# Altium schematic sheet Receiving.SchDoc: Sample Sheet Title
size B; Date: MM/DD/YYYY; Author: Sample Author; Organization: ORGANIZATION; Address1: ADDRESS 1; Address2: ADDRESS 2; Address3: ADDRESS 3; Address4: ADDRESS 4; Revision: -; SheetNumber: 3; SheetTotal: 6; ENG_APP_DATE: --/--/--; DSN_APP_DATE: --/--/--; CHK_APP_DATE: --/--/--
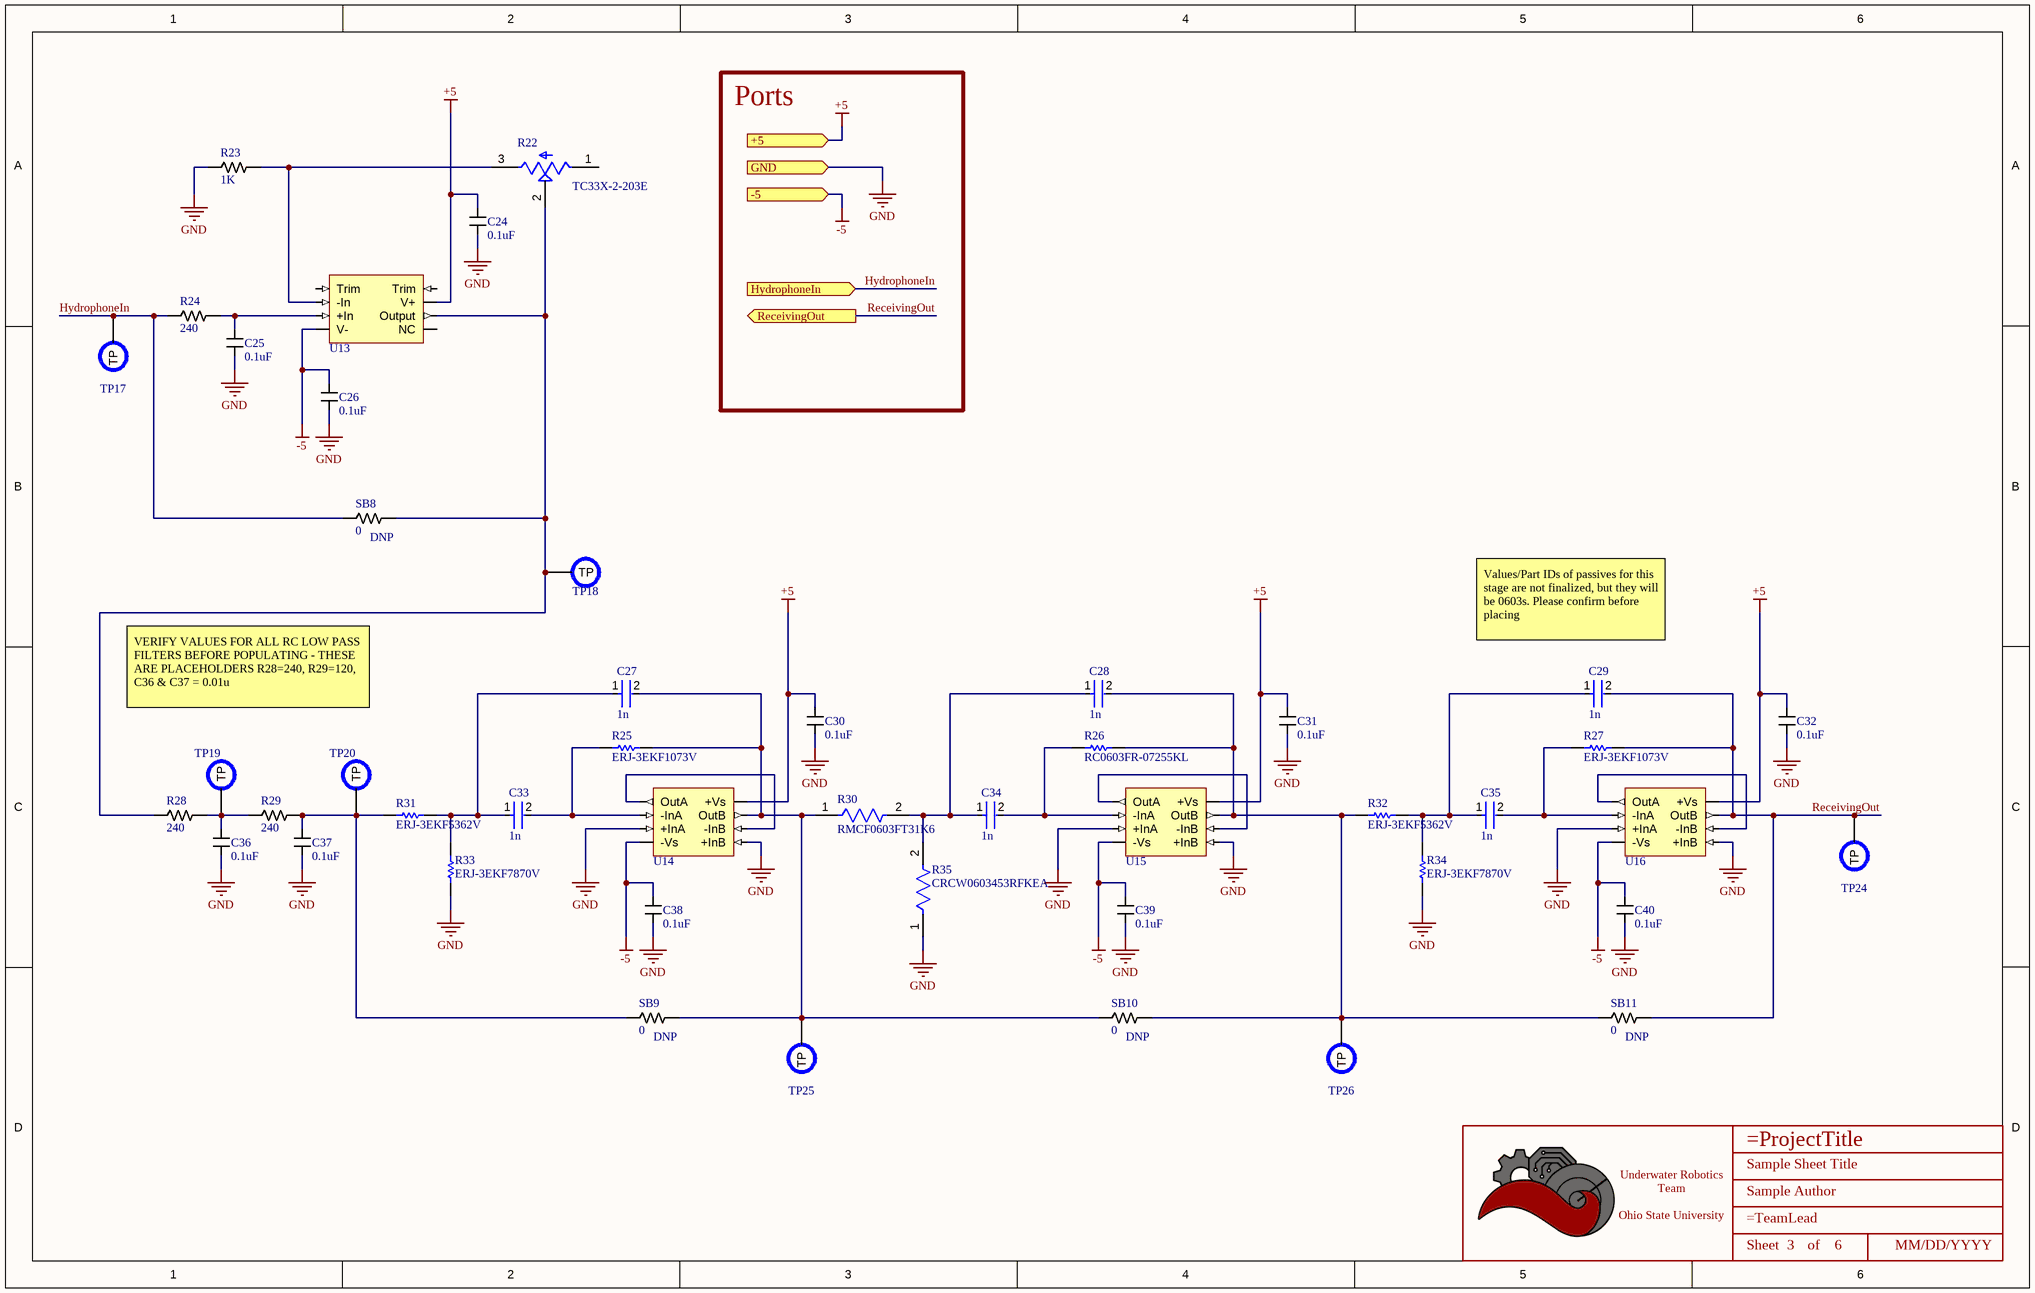
[diagram p0: Receiving.SchDoc]

## Parts
*  Title_Block  [LOGO]  (value not drawn)  (graphical)
C24  value 0.1uF  [CAPACITOR_0603]  (hidden comment: 100nF Ceramic 6.3V)
C25  value 0.1uF  [CAPACITOR_0603]  (hidden comment: 100nF Ceramic 6.3V)
C26  value 0.1uF  [CAPACITOR_0603]  (hidden comment: 100nF Ceramic 6.3V)
C27  1n  [FP-0603-L_1_6_0_15-W_0_81-IPC_A]
C28  1n  [FP-0603-L_1_6_0_15-W_0_81-IPC_A]
C29  1n  [FP-0603-L_1_6_0_15-W_0_81-IPC_A]
C30  value 0.1uF  [CAPACITOR_0603]  (hidden comment: 100nF Ceramic 6.3V)
C31  value 0.1uF  [CAPACITOR_0603]  (hidden comment: 100nF Ceramic 6.3V)
C32  value 0.1uF  [CAPACITOR_0603]  (hidden comment: 100nF Ceramic 6.3V)
C33  1n  [FP-0603-L_1_6_0_15-W_0_81-IPC_A]
C34  1n  [FP-0603-L_1_6_0_15-W_0_81-IPC_A]
C35  1n  [FP-0603-L_1_6_0_15-W_0_81-IPC_A]
C36  value 0.1uF  [CAPACITOR_0603]  (hidden comment: 100nF Ceramic 6.3V)
C37  value 0.1uF  [CAPACITOR_0603]  (hidden comment: 100nF Ceramic 6.3V)
C38  value 0.1uF  [CAPACITOR_0603]  (hidden comment: 100nF Ceramic 6.3V)
C39  value 0.1uF  [CAPACITOR_0603]  (hidden comment: 100nF Ceramic 6.3V)
C40  value 0.1uF  [CAPACITOR_0603]  (hidden comment: 100nF Ceramic 6.3V)
R22  TC33X-2-203E  [TRIM_TC33X-2-203E]
R23  Value  (Ohms): 1K  [RESISTOR_0603]  (hidden comment: 1k Ohm 5% 1/8W)
R24  Value  (Ohms): 240  [RESISTOR_0603]  (hidden comment: RES SMD 240 OHM 5% 1/10W 0603)
R25  ERJ-3EKF1073V  [RESC1608X55X30ML15T15]
R26  RC0603FR-07255KL  [RESC1608X55X25LL10T15]
R27  ERJ-3EKF1073V  [RESC1608X55X30ML15T15]
R28  Value  (Ohms): 240  [RESISTOR_0603]  (hidden comment: RES SMD 240 OHM 5% 1/10W 0603)
R29  Value  (Ohms): 240  [RESISTOR_0603]  (hidden comment: RES SMD 240 OHM 5% 1/10W 0603)
R30  RMCF0603FT31K6  [FP-RMCF0603-IPC_A]
R31  ERJ-3EKF5362V  [RESC1608X55X30NL15T15]
R32  ERJ-3EKF5362V  [RESC1608X55X30NL15T15]
R33  ERJ-3EKF7870V  [RESC1608X55X30ML15T15]
R34  ERJ-3EKF7870V  [RESC1608X55X30ML15T15]
R35  CRCW0603453RFKEA  [FP-CRCW0603-e3-IPC_C]
SB8  Value  (Ohms): 0  [RESISTOR_0603]  (hidden comment: 0 Ohm Jumper No Fit)
SB9  Value  (Ohms): 0  [RESISTOR_0603]  (hidden comment: 0 Ohm Jumper No Fit)
SB10  Value  (Ohms): 0  [RESISTOR_0603]  (hidden comment: 0 Ohm Jumper No Fit)
SB11  Value  (Ohms): 0  [RESISTOR_0603]  (hidden comment: 0 Ohm Jumper No Fit)
TP17  PCB Test Point  [TESTPOINT_1.2MM]  (value not drawn)  (no BOM)
TP18  PCB Test Point  [TESTPOINT_1.2MM]  (value not drawn)  (no BOM)
TP19  PCB Test Point  [TESTPOINT_1.2MM]  (value not drawn)  (no BOM)
TP20  PCB Test Point  [TESTPOINT_1.2MM]  (value not drawn)  (no BOM)
TP24  PCB Test Point  [TESTPOINT_1.2MM]  (value not drawn)  (no BOM)
TP25  PCB Test Point  [TESTPOINT_1.2MM]  (value not drawn)  (no BOM)
TP26  PCB Test Point  [TESTPOINT_1.2MM]  (value not drawn)  (no BOM)
U13  IC OPAMP GP 1 CIRCUIT 8SOIC  [SOIC-8]  (value not drawn)
U14  IC VOLTAGE FEEDBACK 2 CIRC 8SOIC  [SOIC-8]  (value not drawn)
U15  IC VOLTAGE FEEDBACK 2 CIRC 8SOIC  [SOIC-8]  (value not drawn)
U16  IC VOLTAGE FEEDBACK 2 CIRC 8SOIC  [SOIC-8]  (value not drawn)

## Ports
+5 (in), -5 (in), GND (in), HydrophoneIn (in), ReceivingOut (out)

## Nets
+5: C24.1 C30.1 C31.1 C32.1 U13.7(V+) U14.8(+Vs) U15.8(+Vs) U16.8(+Vs) ; port +5
-5: C26.1 C38.1 C39.1 C40.1 U13.4(V-) U14.4(-Vs) U15.4(-Vs) U16.4(-Vs) ; port -5
GND: C24.2 C25.2 C26.2 C30.2 C31.2 C32.2 C36.2 C37.2 C38.2 C39.2 C40.2 R23.2 R33.1 R34.1 R35.1 U14.3(+InA) U14.5(+InB) U15.3(+InA) U15.5(+InB) U16.3(+InA) U16.5(+InB) ; port GND
HydrophoneIn: R24.2 SB8.2 TP17.TP ; port HydrophoneIn
ReceivingOut: C29.2 R27.2 SB11.1 TP24.TP U16.7(OutB) ; port ReceivingOut
NetC25_1: C25.1 R24.1 U13.3(+In)
NetC27_1: C27.1 C33.1 R31.2 R33.2
NetC27_2: C27.2 R25.2 R30.1 SB9.1 SB10.2 TP25.TP U14.7(OutB)
NetC28_1: C28.1 C34.1 R30.2 R35.2
NetC28_2: C28.2 R26.2 R32.1 SB10.1 SB11.2 TP26.TP U15.7(OutB)
NetC29_1: C29.1 C35.1 R32.2 R34.2
NetC33_2: C33.2 R25.1 U14.2(-InA)
NetC34_2: C34.2 R26.1 U15.2(-InA)
NetC35_2: C35.2 R27.1 U16.2(-InA)
NetC36_1: C36.1 R28.1 R29.2 TP19.TP
NetC37_1: C37.1 R29.1 R31.1 SB9.2 TP20.TP
NetR22_2: R22.2(W) R28.2 SB8.1 TP18.TP U13.6(Output)
NetR22_3: R22.3(CW) R23.1 U13.2(-In)
NetU14_1: U14.1(OutA) U14.6(-InB)
NetU15_1: U15.1(OutA) U15.6(-InB)
NetU16_1: U16.1(OutA) U16.6(-InB)

Not connected (* = marked no-connect by the designer): R22 1(CCW); U13 1(Trim) 5(NC) 8(Trim)

## Notes on the sheet
- Ports
- (near SB8) DNP
- Values/Part IDs of passives for this stage are not finalized, but they will be 0603s. Please confirm before placing
- VERIFY VALUES FOR ALL RC LOW PASS FILTERS BEFORE POPULATING - THESE ARE PLACEHOLDERS R28=240, R29=120, C36 & C37 = 0.01u
- (near SB9) DNP
- (near SB10) DNP
- (near SB11) DNP
- DWG. NO.
- REV.
- SHT.
- THIS DOCUMENT AND THE DATA DISCLOSED HEREIN OR HEREWITH IS THE PROPERTY OF ALTIUM LIMITED AND MAY BE FREELY DISTRIBUTED IN WHOLE. NO RIGHTS ARE RESERVED OR EXPRESS OR IMPLIED WARANTEE GIVEN.
- REVISION
- DESCRIPTION
- DATE
- APPROVED
- ENG:
- APPROVALS
- PROJECT
- DSN:
- CHK:
- REFERENCE DOCUMENTS
- PROJECT REVISION:
- TITLE
- DOCUMENT REVISION:
- DESIGN ITEM:
- BOM:
- FAB DWG:
- PCB DWG:
- ASSY DWG:
- SCALE:
- SIZE
- B
- CAGE CODE
- FILE NAME
- DWG NO.
- SHEET
- OF
- REV
- (in symbol Title_Block) Underwater Robotics Team / Ohio State University; Sheet; of

## Library data of the parts
* = Title_Block: UWRT Schematic Title Block Template / Created June 2021, Dylan Trainor
C24-C26 C30-C32 C36-C40 = CAPACITOR_0.1uF_0603: Cap 100nF 6.3V +/-10% / Ceramic 0603; Made By: Flip B; ComponentLink1Description: Datsheet; ComponentLink1URL: https://www.mouser.com/datasheet/2/212/KEM_C1002_X7R_SMD-1102033.pdf; Tolerance: +/- 10%; Voltage: 6.3V; Supplier 1: Digi-Key; Supplier Part Number 1: 399-15351-1-ND
C27-C29 C33-C35 = CMP-2006-04378-2: General Purpose Ceramic Capacitor, 0603, 1nF, 10%, X7R, 15%, 50V; Case Code (Metric): 1608; Min Operating Temperature: -55°C; Weight: 7.1E-05oz; Series: -; Capacitance: 1nF; RoHS Compliant: Yes; Radiation Hardening: No; Height: 0.9mm; Mount: Surface Mount; REACH SVHC: No SVHC; Lead Free: Lead Free; Depth: 0.81mm; Voltage: 50V; Number of Pins: 2; Voltage Rating: 50V; Max Operating Temperature: 125°C; Termination: SMD/SMT; Construction: Flat; Case Code (Imperial): 0603; Dielectric: X7R; Width: 0.032inch; Tolerance: 10%; Case/Package: 0603; Contact Plating: Tin; Packaging: Tape and Reel; Voltage Rating (DC): 50V; Dielectric Material: Ceramic; Package Quantity: 4000; Thickness: 0.035inch; Length: 1.6mm
R22 = TC33X-2-203E: 20 kOhms 0.1W, 1/10W J Lead Surface Mount Trimmer Potentiometer Cermet 1 Turn Top Adjustment; MF: Bourns; Value: *; SnapEDA_Link: https://www.snapeda.com/parts/TC33X-2-203E/Bourns/view-part/312812/?ref=snap; Check_prices: https://www.snapeda.com/parts/TC33X-2-203E/Bourns/view-part/312812/?ref=eda; Digi-Key_Part_Number: TC33X-2-203ECT-ND; Purchase-URL: https://pricing.snapeda.com/search/part/TC33X-2-203E/?ref=eda; Package: 1608 Bourns; MP: TC33X-2-203E; Supplier 1: Mouser; Supplier Part Number 1: 652-TC33X-2-203E
R23 = RESISTOR_1K_0603: RES 1k OHM 5% 1/8W 0603; Tolerance: +/- 5%; Made By: Robert Pafford; ComponentLink1Description: Datasheet; ComponentLink1URL: https://www.bourns.com/docs/product-datasheets/CRxxxxx.pdf; Wattage: 1/8W; Supplier: Digikey; Digikey Part Numer: CR0603-JW-104ELFTR-ND; Supplier 1: Digi-Key; Supplier Part Number 1: 2019-RK73B1JTTD102JCT-ND
R24 R28 R29 = RESISTOR_240_0603: Tolerance: +/- 5%; Made By: John Ulm; ComponentLink1Description: Datasheet; ComponentLink1URL: https://www.bourns.com/docs/product-datasheets/CRxxxxx.pdf; Wattage: 1/10W; Supplier: Digikey; Digikey Part Numer: ERJ-3GEYJ241V; Supplier 1: Digikey; Supplier Part Number 1: P240GCT-ND
R25 R27 = CMP-2000-00194-1: Manufacturer: Panasonic; Part Number: ERJ-3EKF1073V
R26 = CMP-2000-03969-1: Manufacturer: Yageo; Part Number: RC0603FR-07255KL
R30 = CMP-26527-003233-1: 31.6kΩ ±1% 0.1W 0603 Thick Film Chip Resistor AEC-Q200 compliant; Max Power Dissipation: 100mW; Resistance: 31.6kR; Temperature Coefficient: 100ppm/°C; Tolerance: 1%; Features: Automotive AEC-Q200; Packaging: Tape and Reel; Construction: Rectangular; Number of Terminations: 2; Width: 0.031inch; Case Code (Imperial): 0603; Max Operating Temperature: 155°C; Height: 0.022inch; Mount: Surface Mount; Size Code: 0603; Radiation Hardening: No; Contact Plating: Tin; Resistor Type: Thick Film; Case Code (Metric): 1608; Military Standard: Not; Length: 1.55mm; Min Operating Temperature: -55°C; Depth: 0.8mm; Lead Free: Lead Free; RoHS Compliant: Yes; Power Rating: 100mW; Series: RMCF; Case/Package: 0603
R31 R32 = CMP-2000-00556-1: Manufacturer: Panasonic; Part Number: ERJ-3EKF5362V
R33 R34 = CMP-2000-00644-1: Manufacturer: Panasonic; Part Number: ERJ-3EKF7870V
R35 = CMP-2000-03363-2: RES Thick Film, 453Ω, 1%, 0.1W, 100ppm/°C, 0603; Power Rating: 100mW; Working Voltage: 75V; Resistance: 453R; Length: 1.55mm; Min Operating Temperature: -55°C; Case Code (Metric): 1608; Height: 0.02inch; Composition: Thick Film; Max Power Dissipation: 100mW; Termination: SMD/SMT; Number of Terminations: 2; Package Quantity: 5000; Case Code (Imperial): 0603; Temperature Coefficient: 100ppm/°C; Military Standard: Not; Features: Automotive AEC-Q200; Weight: 7.1E-05oz; Depth: 0.85mm; Packaging: Tape and Reel; Number of Pins: 2; Width: 0.033inch; Case/Package: 0603; Tolerance: 1%; Voltage Rating: 75V; Max Operating Temperature: 155°C; Contact Plating: Tin; Radiation Hardening: No
SB8-SB11 = JUMPER_0_0603: 0 Ohm Jumper No Fit for Solder Bridge; Made By: Robert Pafford; ComponentLink1Description: Digikey; ComponentLink1URL: https://www.digikey.com/en/products/detail/koa-speer-electronics-inc/RK73B1JTTD101J/9844701
TP17-TP20 TP24-TP26 = TESTPOINT: Made By: Robert Pafford
U13 = OPA228U: General Purpose Amplifier 1 Circuit 8-SOIC
U14-U16 = OPA2889ID: Voltage Feedback Amplifier 2 Circuit 8-SOIC